# Altium schematic sheet LOCAL_PWR.SchDoc
size 420 x 297 mm; SheetNumber: 8; SheetTotal: 11; ModifiedBy: -; CheckedDate: -; Title2: Title 2; DivGrp: WUT ISE; Designer: G.Kasprowicz
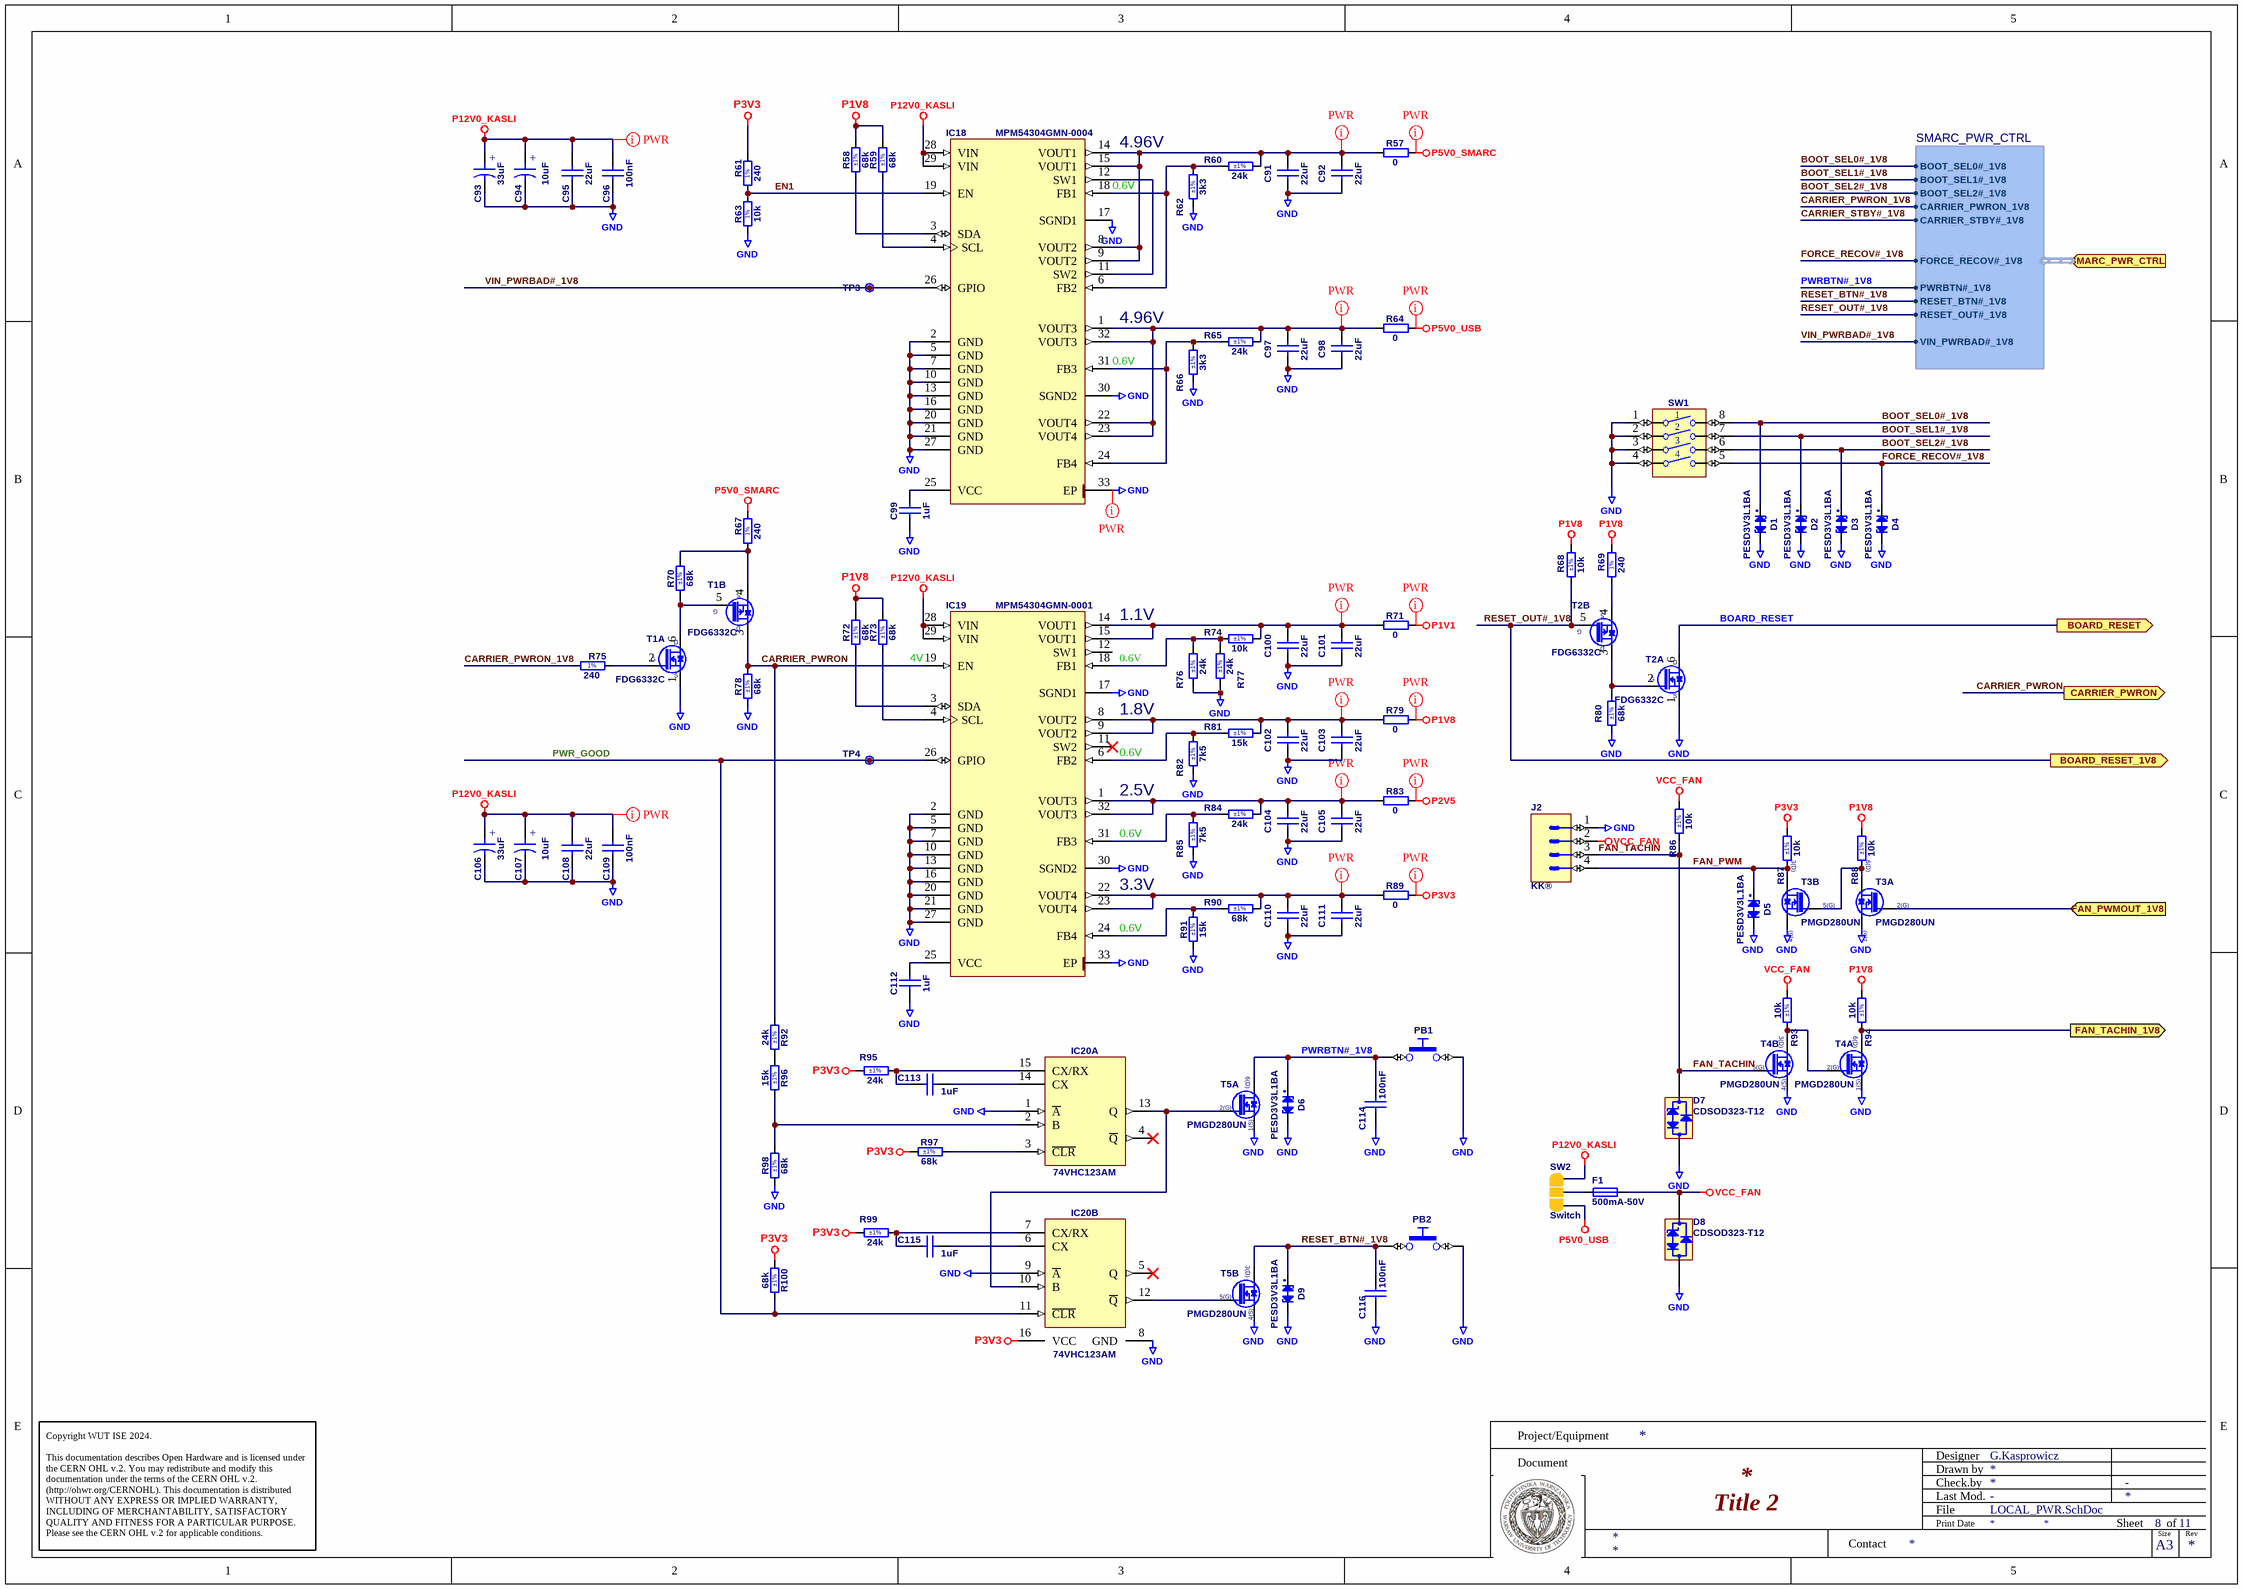
[diagram p0: LOCAL_PWR.SchDoc]

## Parts
C91  22uF  [CAPC2012X135N]
C92  22uF  [CAPC2012X135N]
C93  33uF  [CAPMP3528X210N]
C94  10uF  [CAPMP3216X180N]
C95  22uF  [CAPC2012X135N]
C96  100nF  [CAPC1005X55N]
C97  22uF  [CAPC2012X135N]
C98  22uF  [CAPC2012X135N]
C99  1uF  [CAPC1005X55N]
C100  22uF  [CAPC2012X135N]
C101  22uF  [CAPC2012X135N]
C102  22uF  [CAPC2012X135N]
C103  22uF  [CAPC2012X135N]
C104  22uF  [CAPC2012X135N]
C105  22uF  [CAPC2012X135N]
C106  33uF  [CAPMP3528X210N]
C107  10uF  [CAPMP3216X180N]
C108  22uF  [CAPC2012X135N]
C109  100nF  [CAPC1005X55N]
C110  22uF  [CAPC2012X135N]
C111  22uF  [CAPC2012X135N]
C112  1uF  [CAPC1005X55N]
C113  1uF  [CAPC1005X55N]
C114  100nF  [CAPC1005X55N]
C115  1uF  [CAPC1005X55N]
C116  100nF  [CAPC1005X55N]
D1  PESD3V3L1BA  [SOD2512X110N]
D2  PESD3V3L1BA  [SOD2512X110N]
D3  PESD3V3L1BA  [SOD2512X110N]
D4  PESD3V3L1BA  [SOD2512X110N]
D5  PESD3V3L1BA  [SOD2512X110N]
D6  PESD3V3L1BA  [SOD2512X110N]
D7  CDSOD323-T12  [SOD2513X114N]
D8  CDSOD323-T12  [SOD2513X114N]
D9  PESD3V3L1BA  [SOD2512X110N]
F1  500mA-50V  [FUSC_BOURNS_SF-0603F]
IC18  MPM54304GMN-0004  [MPS_MPM54304GMN]
IC19  MPM54304GMN-0001  [MPS_MPM54304GMN]
IC20  74VHC123AM  [SOIC127P600X175-16N]  (parts A,B of 2)
J2  KK®  [MOLEX_22-04-1041]
PB1  Push Button  [PB_TYCO_FSMSM]  (value not drawn)
PB2  Push Button  [PB_TYCO_FSMSM]  (value not drawn)
R57  0  [RESC2012X60N]
R58  68k  Tolerance: ±1%  [RESC1005X40N]
R59  68k  Tolerance: ±1%  [RESC1005X40N]
R60  24k  Tolerance: ±1%  [RESC1005X40N]
R61  240  [RESC1005X40N]
R62  3k3  Tolerance: ±1%  [RESC1005X40N]
R63  10k  [RESC1005X40N]
R64  0  [RESC2012X60N]
R65  24k  Tolerance: ±1%  [RESC1005X40N]
R66  3k3  Tolerance: ±1%  [RESC1005X40N]
R67  240  [RESC1005X40N]
R68  10k  Tolerance: ±1%  [RESC1005X40N]
R69  240  [RESC1005X40N]
R70  68k  Tolerance: ±1%  [RESC1005X40N]
R71  0  [RESC2012X60N]
R72  68k  Tolerance: ±1%  [RESC1005X40N]
R73  68k  Tolerance: ±1%  [RESC1005X40N]
R74  10k  Tolerance: ±1%  [RESC1005X40N]
R75  240  [RESC1005X40N]
R76  24k  Tolerance: ±1%  [RESC1005X40N]
R77  24k  Tolerance: ±1%  [RESC1005X40N]
R78  68k  Tolerance: ±1%  [RESC1005X40N]
R79  0  [RESC2012X60N]
R80  68k  Tolerance: ±1%  [RESC1005X40N]
R81  15k  Tolerance: ±1%  [RESC1005X40N]
R82  7k5  Tolerance: ±1%  [RESC1005X40N]
R83  0  [RESC2012X60N]
R84  24k  Tolerance: ±1%  [RESC1005X40N]
R85  7k5  Tolerance: ±1%  [RESC1005X40N]
R86  10k  Tolerance: ±1%  [RESC1005X40N]
R87  10k  Tolerance: ±1%  [RESC1005X40N]
R88  10k  Tolerance: ±1%  [RESC1005X40N]
R89  0  [RESC2012X60N]
R90  68k  Tolerance: ±1%  [RESC1005X40N]
R91  15k  Tolerance: ±1%  [RESC1005X40N]
R92  24k  Tolerance: ±1%  [RESC1005X40N]
R93  10k  Tolerance: ±1%  [RESC1005X40N]
R94  10k  Tolerance: ±1%  [RESC1005X40N]
R95  24k  Tolerance: ±1%  [RESC1005X40N]
R96  15k  Tolerance: ±1%  [RESC1005X40N]
R97  68k  Tolerance: ±1%  [RESC1005X40N]
R98  68k  Tolerance: ±1%  [RESC1005X40N]
R99  24k  Tolerance: ±1%  [RESC1005X40N]
R100  68k  Tolerance: ±1%  [RESC1005X40N]
SW1  Switch  [SW_DIPTRONICS_DHA-04TQ]  (value not drawn)
SW2  Switch  [JUMPSM3P]  (no BOM)
T1  FDG6332C  [SOT65P210X110-6N]  (parts A,B of 2)
T2  FDG6332C  [SOT65P210X110-6N]  (parts A,B of 2)
T3  PMGD280UN  [SOT65P210X110-6N]  (parts A,B of 2)
T4  PMGD280UN  [SOT65P210X110-6N]  (parts A,B of 2)
T5  PMGD280UN  [SOT65P210X110-6N]  (parts A,B of 2)
TP3  Test Point  [TPS127]  (value not drawn)  (no BOM)
TP4  Test Point  [TPS127]  (value not drawn)  (no BOM)

## Ports
BOARD_RESET (out), BOARD_RESET_1V8 (out), CARRIER_PWRON (out), FAN_PWMOUT_1V8 (in), FAN_TACHIN_1V8 (out), SMARC_PWR_CTRL (in, harness SMARC_PWR_CTRL)

## Harnesses
SMARC_PWR_CTRL: BOOT_SEL0#_1V8, BOOT_SEL1#_1V8, BOOT_SEL2#_1V8, CARRIER_PWRON_1V8, CARRIER_STBY#_1V8, FORCE_RECOV#_1V8, PWRBTN#_1V8, RESET_BTN#_1V8, RESET_OUT#_1V8, VIN_PWRBAD#_1V8

## Nets
GND: C91.1 C92.1 C93.2 C94.2 C95.1 C96.1 C97.1 C98.1 C99.1 C100.1 C101.1 C102.1 C103.1 C104.1 C105.1 C106.2 C107.2 C108.1 C109.1 C110.1 C111.1 C112.1 C114.1 C116.1 D1.2(C) D2.2(C) D3.2(C) D4.2(C) D5.2(C) D6.2(C) D7.2(A) D8.2(A) D9.2(C) IC18.2(GND) IC18.5(GND) IC18.7(GND) IC18.10(GND) IC18.13(GND) IC18.16(GND) IC18.17(SGND1) IC18.20(GND) IC18.21(GND) IC18.27(GND) IC18.30(SGND2) IC18.33(EP) IC19.2(GND) IC19.5(GND) IC19.7(GND) IC19.10(GND) IC19.13(GND) IC19.16(GND) IC19.17(SGND1) IC19.20(GND) IC19.21(GND) IC19.27(GND) IC19.30(SGND2) IC19.33(EP) IC20.1(~{A}) IC20.8(GND) IC20.9(~{A}) J2.1 PB1.2 PB2.2 R62.1 R63.1 R66.1 R76.1 R77.1 R78.1 R80.1 R82.1 R85.1 R91.1 R98.1 SW1.1 SW1.2 SW1.3 SW1.4 T1.1(S) T2.1(S) T3.1(S) T3.4(S) T4.1(S) T4.4(S) T5.1(S) T5.4(S)
P1V1: R71.2
P1V8: R58.2 R59.2 R68.2 R69.2 R72.2 R73.2 R79.2 R88.2 R94.2
P2V5: R83.2
P3V3: IC20.16(VCC) R61.2 R87.2 R89.2 R95.1 R97.1 R99.1 R100.1
P5V0_SMARC: R57.2 R67.2
P5V0_USB: R64.2 SW2.1
P12V0_KASLI: C93.1 C94.1 C95.2 C96.2 C106.1 C107.1 C108.2 C109.2 IC18.28(VIN) IC18.29(VIN) IC19.28(VIN) IC19.29(VIN) SW2.3
VCC: IC20.16(VCC)
VCC_FAN: D8.1(C) F1.2 J2.2 R86.2 R93.2
BOARD_RESET: T2.6(D) ; port BOARD_RESET
BOOT_SEL0#_1V8: D1.1(C) SW1.8 ; port SMARC_PWR_CTRL.BOOT_SEL0#_1V8
BOOT_SEL1#_1V8: D2.1(C) SW1.7 ; port SMARC_PWR_CTRL.BOOT_SEL1#_1V8
BOOT_SEL2#_1V8: D3.1(C) SW1.6 ; port SMARC_PWR_CTRL.BOOT_SEL2#_1V8
CARRIER_PWRON: IC19.19(EN) R78.2 R92.1 T1.3(D) ; port CARRIER_PWRON
CARRIER_PWRON_1V8: R75.1 ; port SMARC_PWR_CTRL.CARRIER_PWRON_1V8
CARRIER_STBY#_1V8: port SMARC_PWR_CTRL.CARRIER_STBY#_1V8
EN1: IC18.19(EN) R61.1 R63.2
FAN_PWM: D5.1(C) J2.4 R87.1 T3.3(D)
FAN_PWMOUT_1V8: T3.2(G) ; port FAN_PWMOUT_1V8
FAN_TACHIN: D7.1(C) J2.3 R86.1 T4.5(G)
FAN_TACHIN_1V8: R94.1 T4.6(D) ; port FAN_TACHIN_1V8
FORCE_RECOV#_1V8: D4.1(C) SW1.5 ; port SMARC_PWR_CTRL.FORCE_RECOV#_1V8
PWR_GOOD: IC19.26(GPIO) IC20.11(~{CLR}) R100.2 TP4.1
PWRBTN#_1V8: C114.2 D6.1(C) PB1.1 T5.6(D) ; port SMARC_PWR_CTRL.PWRBTN#_1V8
RESET_BTN#_1V8: C116.2 D9.1(C) PB2.1 T5.3(D) ; port SMARC_PWR_CTRL.RESET_BTN#_1V8
RESET_OUT#_1V8: R68.1 T2.5(G) ; port BOARD_RESET_1V8, port SMARC_PWR_CTRL.RESET_OUT#_1V8
VIN_PWRBAD#_1V8: IC18.26(GPIO) TP3.1 ; port SMARC_PWR_CTRL.VIN_PWRBAD#_1V8
NetC91_2: C91.2 C92.2 IC18.8(VOUT2) IC18.9(VOUT2) IC18.14(VOUT1) IC18.15(VOUT1) R57.1 R60.2
NetC97_2: C97.2 C98.2 IC18.1(VOUT3) IC18.22(VOUT4) IC18.23(VOUT4) IC18.32(VOUT3) R64.1 R65.2
NetC99_2: C99.2 IC18.25(VCC)
NetC100_2: C100.2 C101.2 IC19.14(VOUT1) IC19.15(VOUT1) R71.1 R74.2
NetC102_2: C102.2 C103.2 IC19.8(VOUT2) IC19.9(VOUT2) R79.1 R81.2
NetC104_2: C104.2 C105.2 IC19.1(VOUT3) IC19.32(VOUT3) R83.1 R84.2
NetC110_2: C110.2 C111.2 IC19.22(VOUT4) IC19.23(VOUT4) R89.1 R90.2
NetC112_2: C112.2 IC19.25(VCC)
NetC113_1: C113.1 IC20.15(CX/RX) R95.2
NetC113_2: C113.2 IC20.14(CX)
NetC115_1: C115.1 IC20.7(CX/RX) R99.2
NetC115_2: C115.2 IC20.6(CX)
NetF1_1: F1.1 SW2.2
NetIC18_3: IC18.3(SDA) R58.1
NetIC18_4: IC18.4(SCL) R59.1
NetIC18_6: IC18.6(FB2) IC18.18(FB1) R60.1 R62.2
NetIC18_11: IC18.11(SW2) IC18.12(SW1)
NetIC18_24: IC18.24(FB4) IC18.31(FB3) R65.1 R66.2
NetIC19_3: IC19.3(SDA) R72.1
NetIC19_4: IC19.4(SCL) R73.1
NetIC19_6: IC19.6(FB2) R81.1 R82.2
NetIC19_18: IC19.18(FB1) R74.1 R76.2 R77.2
NetIC19_24: IC19.24(FB4) R90.1 R91.2
NetIC19_31: IC19.31(FB3) R84.1 R85.2
NetIC20_2: IC20.2(B) R96.2 R98.2
NetIC20_3: IC20.3(~{CLR}) R97.2
NetIC20_10: IC20.10(B) IC20.13(Q) T5.2(G)
NetIC20_12: IC20.12(~{Q}) T5.5(G)
NetR67_1: R67.1 R70.2 T1.4(S)
NetR69_1: R69.1 T2.4(S)
NetR70_1: R70.1 T1.5(G) T1.6(D)
NetR75_2: R75.2 T1.2(G)
NetR80_2: R80.2 T2.2(G) T2.3(D)
NetR88_1: R88.1 T3.5(G) T3.6(D)
NetR92_2: R92.2 R96.1
NetR93_1: R93.1 T4.2(G) T4.3(D)

Not connected (* = marked no-connect by the designer): IC19 11(SW2)* 12(SW1); IC20 4(~{Q})* 5(Q)*

## Layout directives
net class PWR: GND, NetC91_2, NetC97_2, NetC100_2, NetC102_2, NetC104_2, NetC110_2, P1V1, P1V8, P2V5, P3V3, P5V0_SMARC, P5V0_USB, P12V0_KASLI

## Notes on the sheet
- (near IC18) 0.6V
- 4.96V
- 4V
- 0.6V
- 1.1V
- 1.8V
- 2.5V
- 3.3V
- Project/Equipment
- Document
- Designer
- Drawn by
- Check.by
- Copyright WUT ISE 2024.
  This documentation describes Open Hardware and is licensed under the CERN OHL v.2. You may redistribute and modify this documentation under the terms of the CERN OHL v.2. (http://ohwr.org/CERNOHL). This documentation is distributed WITHOUT ANY EXPRESS OR IMPLIED WARRANTY, INCLUDING OF MERCHANTABILITY, SATISFACTORY QUALITY AND FITNESS FOR A PARTICULAR PURPOSE. Please see the CERN OHL v.2 for applicable conditions.
- Contact
- File
- Last Mod.
- Print Date
- Sheet
- Size
- A3
- of
- Rev
- (in symbol CTE3216-18_10UF_16V_20%_AVX_TCJ) +
- (in symbol CTE3528-21_33UF_16V_10%) +
- (in symbol PMGD280UN, part A) 6(D); 2(G); 1(S)
- (in symbol PMGD280UN, part B) 3(D); 5(G); 4(S)
- (in symbol R0402_10K_1%_0.0625W_100PPM) 1%
- (in symbol R0402_240R_1%_0.0625W_100PPM) 1%

## Library data of the parts
C91 C92 C95 C97 C98 C100-C105 C108 C110 C111 = CC0805_22UF_16V_10%_X5R: Non-polarised capacitor; Manufacturer: GENERIC; Part Description: SMD Multilayer Chip Ceramic Capacitor; Manufacturer1 Part Number: C2012X5R1C226KT; Tolerance: ±10%; Voltage: 16V; TC: X5R; Manufacturer Part Number: CC0805_22UF_16V_10%_X5R; Part Number: CC0805_22UF_16V_10%_X5R; Value: 22uF; Component Kind: Standard; Component Type: Standard; Pin Count: 2; Status: Preferred; Case: 0805; Mounted: Yes; Socket: No; SMD: Yes; Sense: No; Manufacturer1 Example: TDK; Manufacturer1 ComponentHeight: 1.35mm; HelpURL: \\cern.ch\dfs\Applications\Altium\Datasheets\CC0805_X5R_TDK_C.pdf; Author: CERN DEM JLC; CreateDate: 25.10.2012; LatestRevisionDate: 25.10.2012
C93 C106 = CTE3528-21_33UF_16V_10%: Polarised capacitor; Part Description: Solid Tantalum Chip Capacitor; Manufacturer: GENERIC; Manufacturer1 Part Number: TAJB336K016R; Voltage: 16V; Tolerance: ±10%; Part Number: CTE3528-21_33UF_16V_10%; Component Kind: Standard; Component Type: Standard; Pin Count: 2; Value: 33uF; Status: Preferred; Manufacturer Part Number: CTE3528-21_33UF_16V_10%; Case: B; Mounted: Yes; Socket: No; SMD: Yes; Sense: No; HelpURL: \\cern.ch\dfs\Applications\Altium\Datasheets\CTE_AVX_TAJ.pdf; Author: CERN DEM JLC; CreateDate: 03.12.2007; LatestRevisionDate: 03.12.2007; Manufacturer1 Example: AVX; Manufacturer1 ComponentHeight: 2.1mm
C94 C107 = CTE3216-18_10UF_16V_20%_AVX_TCJ: Polarised capacitor; Part Description: ESR 0R200 Tantalum Solid Electrolytic Chip Capacitor with Conductive Polymer Electrode; Manufacturer: AVX; Manufacturer Part Number: TCJA106M016R0200; Voltage: 16V; Tolerance: ±20%; Part Number: CTE3216-18_10UF_16V_20%_AVX_TCJ; Component Kind: Standard; Component Type: Standard; Pin Count: 2; Value: 10uF; Status: Preferred; Case: A; Mounted: Yes; Socket: No; SMD: Yes; Sense: No; ComponentHeight: 1.8mm; HelpURL: \\cern.ch\dfs\Applications\Altium\Datasheets\CTE_AVX_TCJ.pdf; Author: CERN DEM JLC; CreateDate: 29.03.2012; LatestRevisionDate: 29.03.2012
C96 C109 C114 C116 = CC0402_100NF_16V_10%_X7R: Non-polarised capacitor; Part Description: SMD Multilayer Chip Ceramic Capacitor; Manufacturer: GENERIC; Manufacturer1 Part Number: GRM155R71C104KA88D; Voltage: 16V; TC: X7R; Tolerance: ±10%; Part Number: CC0402_100NF_16V_10%_X7R; Component Kind: Standard; Component Type: Standard; Pin Count: 2; Value: 100nF; Status: Not Recommended; Manufacturer Part Number: CC0402_100NF_16V_10%_X7R; Case: 0402; Mounted: Yes; Socket: No; SMD: Yes; Sense: No; Manufacturer1 Example: MURATA; Manufacturer1 ComponentHeight: 0.55mm; HelpURL: \\cern.ch\dfs\Applications\Altium\Datasheets\CC0402_X7R_MURATA_GRM.pdf; Author: CERN DEM JLC; CreateDate: 05/12/2013; LatestRevisionDate: 03/12/2007
C99 C112 C113 C115 = CC0402_1UF_16V_10%_X5R: Non-polarised capacitor; Part Description: SMD Multilayer Chip Ceramic Capacitor; Manufacturer: GENERIC; Manufacturer1 Part Number: C1005X5R1C105KT; Voltage: 16V; TC: X5R; Tolerance: ±10%; Part Number: CC0402_1UF_16V_10%_X5R; Component Kind: Standard; Component Type: Standard; Pin Count: 2; Value: 1uF; Status: Preferred; Manufacturer Part Number: CC0402_1UF_16V_10%_X5R; Case: 0402; Mounted: Yes; Socket: No; SMD: Yes; Sense: No; Manufacturer1 Example: TDK; Manufacturer1 ComponentHeight: 0.55mm; HelpURL: \\cern.ch\dfs\Applications\Altium\Datasheets\CC0402_X5R_TDK_C.pdf; Author: CERN DEM JLC
  C99 C112: CreateDate: 25.10.2012; LatestRevisionDate: 25.10.2012
  C113 C115: CreateDate: 2012-10-25; LatestRevisionDate: 2012-10-25
D1-D6 D9 = PESD3V3L1BA: Bi-Directional ESD Protection Diode; Part Description: Low Capacitance 23kV Bidirectional ESD Protection Diode; Manufacturer: NEXPERIA; Voltage: 3V3; Power: 500W; PressFit: No; Bonding: No; Part Number: PESD3V3L1BA; Component Kind: Standard; Component Type: Standard; Device: PESD3V3L1BA; PackageDescription: Small Outline Diode (SOD323), 1.70mm W X 1.25mm L X 1.10mm H Body,  IPC Medium Density; Manufacturer Part Number: PESD3V3L1BA; Pin Count: 2; Case: SOD323; Mounted: Yes; Socket: No; SMD: Yes; Sense: No; ComponentHeight: 1.1mm; HelpURL: \\cern.ch\dfs\Applications\Altium\Datasheets\PESD3V3L1BA.pdf; Author: CERN DEM JMW; CreateDate: 28.07.2021; LatestRevisionDate: 28.07.2021
D7 D8 = CDSOD323-T12: Unidirectional ESD Protection for Transient Voltage Suppressor Diode; Manufacturer: BOURNS; Voltage: 12V; Power: 350W; PressFit: No; Bonding: No; Part Number: CDSOD323-T12; Component Kind: Standard; Component Type: Standard; Device: CDSOD323-T12; PackageDescription: SOD-323 Diode; 1.75mm W X 1.30mm L X 1.14mm H Body, IPC Medium Density; Part Description: Unidirectional ESD Protection for Transient Voltage Suppressor Diode; Manufacturer Part Number: CDSOD323-T12; Pin Count: 2; Case: SOD-323; Mounted: Yes; Socket: No; SMD: Yes; Sense: No; ComponentHeight: 1.14mm; HelpURL: \\cern.ch\dfs\Applications\Altium\Datasheets\CDSOD323-T12.pdf; Author: CERN DEM BC; CreateDate: 26.07.2017; LatestRevisionDate: 26.07.2017
F1 = FUS0603_BOURNS-SF-0603F050-2: Fuse; Part Description: Fast Acting Thin Film Chip Fuse for Overcurrent Protection, SinglFuse™ SF-0603F  Series; Manufacturer: BOURNS; PressFit: No; Part Number: FUS0603_BOURNS-SF-0603F050-2; Component Kind: Standard; Component Type: Standard; Pin Count: 2; Case: 0603; PackageDescription: Chip Fuse, 2-Leads, Body 1.6mm x 0.8mm, IPC Medium Density; Family: Fuse; Mounted: Yes; Socket: No; SMD: Yes; Sense: No; Value: 500mA-50V; Manufacturer Part Number: SF-0603F050-2; ComponentHeight: 0.55mm; HelpURL: \\cern.ch\dfs\Applications\Altium\Datasheets\FUSC_BOURNS_SF-0603F.pdf; Author: CERN DEM JLC; CreateDate: 01.02.2017; LatestRevisionDate: 01.02.2017
IC18 = MPM54304GMN-XXXX: Quad-Output Power Module with I2C and MTP; Part Number: MPM54304GMN-002; Part Description: 4V to 16V Input, Quad-Output Power Module with I2C and MTP; Manufacturer: MPS (MONOLITIC  POWER SYSTEMS); PressFit: No; Bonding: No; Component Kind: Standard; Component Type: Standard; Device: MPM54304GMN-0004; PackageDescription: MPS LGA-33 Case, 0.65mm Pitch, Rect.; 32 Pin, 7.00mm L X 7.00mm W X 2.10mm H body (w/Thermal Tab 3.55 X 3.55mm); Manufacturer Part Number: MPM54304GMN-002; Pin Count: 33; Case: QFN32; Mounted: Yes; Socket: No; SMD: Yes; Sense: No; ComponentHeight: 2.1mm; HelpURL: \\cern.ch\dfs\Applications\Altium\Datasheets\MPM54304GMN.pdf; Author: CERN DEM BC; CreateDate: 09.11.2020; LatestRevisionDate: 23.11.2022
IC19 = MPM54304GMN-XXXX: Quad-Output Power Module with I2C and MTP; Part Description: 4V to 16V Input, Quad-Output Power Module with I2C and MTP; Manufacturer: MPS (MONOLITIC  POWER SYSTEMS); Manufacturer Part Number: MPM54304GMN-002; PressFit: No; Bonding: No; Part Number: MPM54304GMN-0001; Component Kind: Standard; Component Type: Standard; Device: MPM54304GMN-0001; PackageDescription: MPS LGA-33 Case, 0.65mm Pitch, Rect.; 32 Pin, 7.00mm L X 7.00mm W X 2.10mm H body (w/Thermal Tab 3.55 X 3.55mm); Pin Count: 33; Case: QFN32; Mounted: Yes; Socket: No; SMD: Yes; Sense: No; ComponentHeight: 2.1mm; HelpURL: \\cern.ch\dfs\Applications\Altium\Datasheets\MPM54304GMN.pdf; Author: CERN DEM BC; CreateDate: 09.11.2020; LatestRevisionDate: 23.11.2022
IC20 = 74VHC123AM: Retriggerable Monostable Multivibrator; Part Description: Dual Retriggerable Monostable Multivibrator; Manufacturer: FAIRCHILD SEMICONDUCTOR; PressFit: No; Bonding: No; Part Number: 74VHC123AM; Component Kind: Standard; Component Type: Standard; Device: 74VHC123AM; PackageDescription: SOIC, 1.27mm Pitch; 16 Pin, 3.90mm W x 9.90mm L X 1.75mm H Body, IPC Medium Density; Manufacturer Part Number: 74VHC123AM; Pin Count: 16; Case: SOIC16; Mounted: Yes; Socket: No; SMD: Yes; Sense: No; ComponentHeight: 1.75mm; Author: CERN DEM BC; HelpURL: \\cern.ch\dfs\Applications\Altium\Datasheets\74VHC123AM.pdf; CreateDate: 23.08.2016; LatestRevisionDate: 23.08.2016
J2 = MOLEX_22-04-1041: Connector 4 Male; Part Description: 2.5mm (.100") Pitch KK® Wire-to-Board Header, Vertical, with Friction Lock, 4 Circuits, Tin (Sn) Plating; Manufacturer: MOLEX; PressFit: No; Part Number: MOLEX_22-04-1041; Component Kind: Standard; Component Type: Standard; Pin Count: 4; Family: KK®; Mounted: Yes; Socket: No; SMD: No; Sense: No; Status: Obsolete; Manufacturer Part Number: 22-04-1041; ComponentHeight: 11.7mm; HelpURL: \\cern.ch\dfs\Applications\Altium\Datasheets\MOLEX_22-04-1041.pdf; Author: CERN DEM JLC; CreateDate: 09.02.2012; LatestRevisionDate: 09.02.2012
PB1 PB2 = PB_TYCO_FSMSM: Push-Button Switch SPST; Part Description: 12VDC 50mA SPST Tactile Push-Button Switch; Manufacturer: TYCO ELECTRONICS; Manufacturer Part Number: FSMSM or 1437566-3; PressFit: No; Part Number: PB_TYCO_FSMSM; Component Kind: Standard; Component Type: Standard; Pin Count: 2; PackageDescription: Body 3.5x6.0mm, Pushbutton Switch, TYCO ALCOSWITCH FSMSM Serie; Family: Push Button; Mounted: Yes; Socket: No; SMD: Yes; Sense: No; Status: None; ComponentHeight: 4.3mm; HelpURL: \\cern.ch\dfs\Applications\Altium\Datasheets\PB_TYCO_FSMSM.pdf; Author: CERN DEM JLC; CreateDate: 30.06.2008; LatestRevisionDate: 21.06.2012
R57 R64 R71 R79 R83 R89 = R0805_0R_JUMPER: Resistor; Part Description: 2A (0.05R Max DC Resistance) Zero Ohm Jumper; Manufacturer: GENERIC; Manufacturer1 Part Number: NRC10Z0; PressFit: No; Part Number: R0805_0R_JUMPER; Component Kind: Standard; Component Type: Standard; Pin Count: 2; Value: 0; Status: Preferred; Manufacturer Part Number: R0805_0R_JUMPER; Case: 0805; Mounted: Yes; Sense: No; Socket: No; SMD: Yes; Manufacturer1 Example: NIC COMPONENT; Manufacturer1 ComponentHeight: 0.6mm; HelpURL: \\cern.ch\dfs\Applications\Altium\Datasheets\R0805_NIC_NRC.pdf; Author: CERN DEM JLC; CreateDate: 03.12.2007; LatestRevisionDate: 13.03.2008
R58 R59 R70 R72 R73 R78 R80 R90 R97 R98 R100 = R0402_68K_1%_0.0625W_100PPM: Resistor - 1%; Part Description: General Purpose Thick Film Chip Resistor; Manufacturer: GENERIC; Manufacturer1 Part Number: 232270676803L; TC: ±100ppm/°C; PressFit: No; Part Number: R0402_68K_1%_0.0625W_100PPM; Component Kind: Standard; Component Type: Standard; Pin Count: 2; Value: 68k; Status: Not Recommended; Power: 0.0625W; Manufacturer Part Number: R0402_68K_1%_0.0625W_100PPM; Case: 0402; Mounted: Yes; Sense: No; Socket: No; SMD: Yes; Manufacturer1 Example: YAGEO PHYCOMP; Manufacturer1 ComponentHeight: 0.4mm; HelpURL: \\cern.ch\dfs\Applications\Altium\Datasheets\R0402_Phycomp_RC0402.pdf; Author: CERN DEM JLC; CreateDate: 03.12.2007; LatestRevisionDate: 17.10.2012
R60 R65 R76 R77 R84 R92 R95 R99 = R0402_24K_1%_0.0625W_100PPM: Resistor - 1%; Part Description: General Purpose Thick Film Chip Resistor; Manufacturer: GENERIC; Manufacturer1 Part Number: 232270672403L; TC: ±100ppm/°C; PressFit: No; Part Number: R0402_24K_1%_0.0625W_100PPM; Component Kind: Standard; Component Type: Standard; Pin Count: 2; Value: 24k; Status: Not Recommended; Power: 0.0625W; Manufacturer Part Number: R0402_24K_1%_0.0625W_100PPM; Case: 0402; Mounted: Yes; Sense: No; Socket: No; SMD: Yes; Manufacturer1 Example: YAGEO PHYCOMP; Manufacturer1 ComponentHeight: 0.4mm; HelpURL: \\cern.ch\dfs\Applications\Altium\Datasheets\R0402_Phycomp_RC0402.pdf; Author: CERN DEM JLC; CreateDate: 03.12.2007; LatestRevisionDate: 17.10.2012
R61 R67 R69 R75 = R0402_240R_1%_0.0625W_100PPM: Resistor - 1%; Part Description: General Purpose Thick Film Chip Resistor; Manufacturer: GENERIC; Manufacturer1 Part Number: 232270672401L; TC: ±100ppm/°C; PressFit: No; Part Number: R0402_240R_1%_0.0625W_100PPM; Component Kind: Standard; Component Type: Standard; Pin Count: 2; Value: 240; Status: Not Recommended; Power: 0.0625W; Tolerance: ±1%; Manufacturer Part Number: R0402_240R_1%_0.0625W_100PPM; Case: 0402; Mounted: Yes; Sense: No; Socket: No; SMD: Yes; Manufacturer1 Example: YAGEO PHYCOMP; Manufacturer1 ComponentHeight: 0.4mm; HelpURL: \\cern.ch\dfs\Applications\Altium\Datasheets\R0402_Phycomp_RC0402.pdf; Author: CERN DEM JLC; CreateDate: 03.12.2007; LatestRevisionDate: 17.10.2012
R62 R66 = R0402_3K3_1%_0.0625W_100PPM: Resistor - 1%; Part Description: General Purpose Thick Film Chip Resistor; Manufacturer: GENERIC; Manufacturer1 Part Number: 232270673302L; TC: ±100ppm/°C; PressFit: No; Part Number: R0402_3K3_1%_0.0625W_100PPM; Component Kind: Standard; Component Type: Standard; Pin Count: 2; Value: 3k3; Status: Not Recommended; Power: 0.0625W; Manufacturer Part Number: R0402_3K3_1%_0.0625W_100PPM; Case: 0402; Mounted: Yes; Sense: No; Socket: No; SMD: Yes; Manufacturer1 Example: YAGEO PHYCOMP; Manufacturer1 ComponentHeight: 0.4mm; HelpURL: \\cern.ch\dfs\Applications\Altium\Datasheets\R0402_Phycomp_RC0402.pdf; Author: CERN DEM JLC; CreateDate: 03.12.2007; LatestRevisionDate: 17.10.2012
R63 R68 R74 R86-R88 R93 R94 = R0402_10K_1%_0.0625W_100PPM: Resistor - 1%; Part Description: General Purpose Thick Film Chip Resistor; Manufacturer: GENERIC; Manufacturer1 Part Number: 232270671003L; TC: ±100ppm/°C; PressFit: No; Part Number: R0402_10K_1%_0.0625W_100PPM; Component Kind: Standard; Component Type: Standard; Pin Count: 2; Value: 10k; Status: Not Recommended; Power: 0.0625W; Manufacturer Part Number: R0402_10K_1%_0.0625W_100PPM; Case: 0402; Mounted: Yes; Sense: No; Socket: No; SMD: Yes; Manufacturer1 Example: YAGEO PHYCOMP; Manufacturer1 ComponentHeight: 0.4mm; HelpURL: \\cern.ch\dfs\Applications\Altium\Datasheets\R0402_Phycomp_RC0402.pdf; Author: CERN DEM JLC; CreateDate: 03.12.2007; LatestRevisionDate: 17.10.2012
  R63: Tolerance: ±1%
R81 R91 R96 = R0402_15K_1%_0.0625W_100PPM: Resistor - 1%; Part Description: General Purpose Thick Film Chip Resistor; Manufacturer: GENERIC; Manufacturer1 Part Number: CRCW040215K0FK; TC: ±100ppm/°C; PressFit: No; Part Number: R0402_15K_1%_0.0625W_100PPM; Component Kind: Standard; Component Type: Standard; Pin Count: 2; Value: 15k; Status: Preferred; Power: 0.0625W; Manufacturer Part Number: R0402_15K_1%_0.0625W_100PPM; Case: 0402; Mounted: Yes; Sense: No; Socket: No; SMD: Yes; Manufacturer1 Example: VISHAY; Manufacturer1 ComponentHeight: 0.4mm; HelpURL: \\cern.ch\dfs\Applications\Altium\Datasheets\R0402_VISHAY_CRCW e3.pdf; Author: CERN DEM JMW; CreateDate: 06.07.2015; LatestRevisionDate: 06.07.2015
R82 R85 = R0402_7K5_1%_0.0625W_100PPM: Resistor - 1%; Part Description: General Purpose Thick Film Chip Resistor; Manufacturer: GENERIC; Manufacturer1 Part Number: 232270677502L; TC: ±100ppm/°C; PressFit: No; Part Number: R0402_7K5_1%_0.0625W_100PPM; Component Kind: Standard; Component Type: Standard; Pin Count: 2; Value: 7k5; Status: Not Recommended; Power: 0.0625W; Manufacturer Part Number: R0402_7K5_1%_0.0625W_100PPM; Case: 0402; Mounted: Yes; Sense: No; Socket: No; SMD: Yes; Manufacturer1 Example: YAGEO PHYCOMP; Manufacturer1 ComponentHeight: 0.4mm; HelpURL: \\cern.ch\dfs\Applications\Altium\Datasheets\R0402_Phycomp_RC0402.pdf; Author: CERN DEM JLC; CreateDate: 03.12.2007; LatestRevisionDate: 17.10.2012
SW1 = SW_DIPTRONICS_DHA-04TQ: 4 Ways SPST DIP Switch; Part Description: 4 Way SPST SMD DIP Switch, Latched, Contact Rating 25mA 24VDC, DHA Series; PressFit: No; Part Number: SW_DIPTRONICS_DHA-04TQ; Component Kind: Standard; Component Type: Standard; Pin Count: 8; PackageDescription: Pitch 1.27mm, Body 6.2x6.2mm, 4 Ways SPST Surface-Mount DIP Switch, DIPTRONICS DHA Series; Family: Switch; Mounted: Yes; Socket: No; SMD: Yes; Sense: No; Status: None; Manufacturer: DIPTRONICS; Manufacturer Part Number: DHA-04TQ; ComponentHeight: 2.3mm; HelpURL: \\cern.ch\dfs\Applications\Altium\Datasheets\SW_DIPTRONICS_DHA-04TQ.pdf; Author: CERN DEM JLC; CreateDate: 30.05.2017; LatestRevisionDate: 30.05.2017
SW2 = JUMPSM3P: 3 SMD Pads for Bound by Solder  Drop; Part Description: 3 Pads for Bound by Solder Drop; Manufacturer: None; Mounted: No; PressFit: No; Part Number: JUMPSM3P; Component Type: Standard (No BOM); Pin Count: 3; PackageDescription: 3 Pads for Bound by Solder Drop; Family: Switch; Socket: No; SMD: No; Sense: No; Status: None; Manufacturer Part Number: None; ComponentHeight: 0mm; HelpURL: None; Author: CERN DEM JLC; CreateDate: 19.11.2013; LatestRevisionDate: 12.02.2021
T1 T2 = FDG6332C: 20V N & P-Channel PowerTrench MOSFETs; Part Description: 20V, N & P-Channel PowerTrench® MOSFETs; Manufacturer: FAIRCHILD SEMICONDUCTOR; PressFit: No; Bonding: No; Part Number: FDG6332C; Component Kind: Standard; Component Type: Standard; Device: FDG6332C; PackageDescription: SOT363, SC-88, 0.65mm Pitch; 6 Pin, 1.25mm W X 2.00mm L X 1.10mm H body, IPC Medium Density; Manufacturer Part Number: FDG6332C; Pin Count: 6; Case: SOT363; Mounted: Yes; Socket: No; SMD: Yes; Sense: No; ComponentHeight: 1.1mm; HelpURL: \\cern.ch\dfs\Applications\Altium\Datasheets\FDG6332C.pdf; Author: CERN DEM JLC; CreateDate: 25.11.2008; LatestRevisionDate: 25.11.2008
T3-T5 = PMGD280UN: Dual N-Channel micro TrenchMOS™ Ultra Low Level FET; Part Description: 20V 870mA Dual N-Channel micro TrenchMOS™ Ultra Low Level FET; Manufacturer: NXP SEMICONDUCTORS; PressFit: No; Bonding: No; Part Number: PMGD280UN; Component Kind: Standard; Component Type: Standard; Device: PMGD280UN; PackageDescription: SOT363, SC70-6, 0.65mm Pitch; 6 Pin, 1.25mm W X 2.00mm L X 1.10mm H body, IPC Medium Density; Manufacturer Part Number: PMGD280UN; Pin Count: 6; Case: SOT363; Mounted: Yes; Socket: No; SMD: Yes; Sense: No; ComponentHeight: 1.1mm; HelpURL: \\cern.ch\dfs\Applications\Altium\Datasheets\PMGD280UN.pdf; Author: CERN DEM JLC; CreateDate: 19.11.2014; LatestRevisionDate: 19.11.2014
TP3 TP4 = SMD_PAD_1.27X1.27MM: Part Description: 1.27mm x 1.27mm PCB Copper Area (SMD Test Point); Mounted: No; Part Number: SMD_PAD_1.27X1.27MM; Component Type: Standard (No BOM); Pin Count: 1; Family: Test Point; Socket: No; SMD: Yes; Sense: No; Status: None; ComponentHeight: 0mm; HelpURL: Undefined; Author: CERN DEM JLC; CreateDate: 12.01.2008; LatestRevisionDate: 12.01.2008; PackageDescription: 1.27mm x 1.27mm PCB Copper Area (SMD Test Point)